# EAGLE design usir_board (EAGLE 7.1.0)
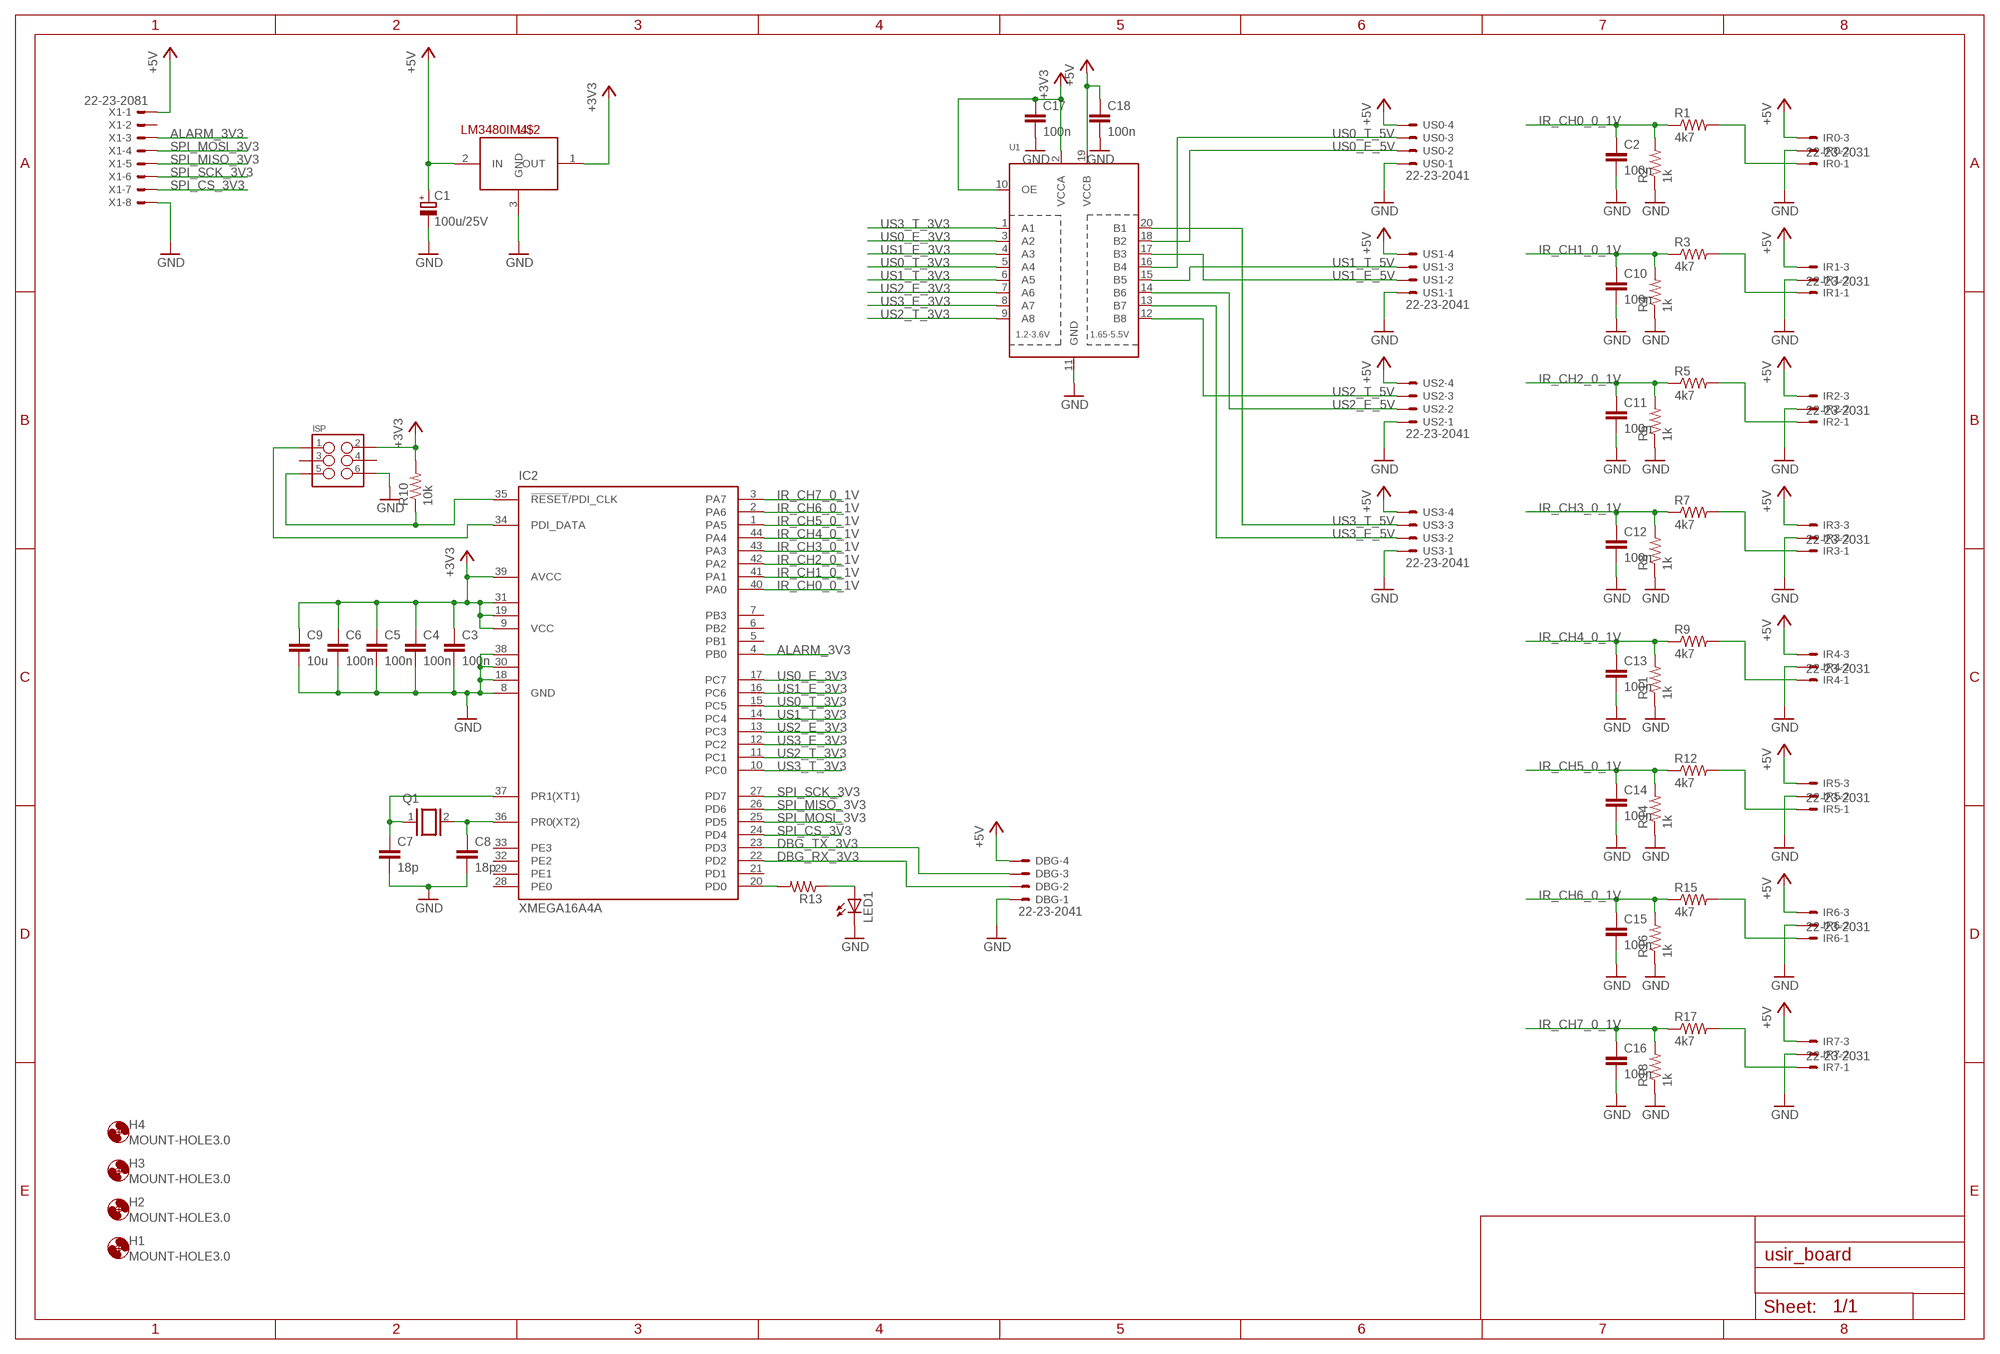
[diagram p0: schematic, sheet 1]

## Parts
C1  100u/25V  CPOL-EUE  [PANASONIC_E]
C2  100n  C-EUC0603  [C0603]
C3  100n  C-EUC0603  [C0603]
C4  100n  C-EUC0603  [C0603]
C5  100n  C-EUC0603  [C0603]
C6  100n  C-EUC0603  [C0603]
C7  18p  C-EUC0603  [C0603]
C8  18p  C-EUC0603  [C0603]
C9  10u  C-EUC0805  [C0805]
C10  100n  C-EUC0603  [C0603]
C11  100n  C-EUC0603  [C0603]
C12  100n  C-EUC0603  [C0603]
C13  100n  C-EUC0603  [C0603]
C14  100n  C-EUC0603  [C0603]
C15  100n  C-EUC0603  [C0603]
C16  100n  C-EUC0603  [C0603]
C17  100n  C-EUC0603  [C0603]
C18  100n  C-EUC0603  [C0603]
DBG  22-23-2041  [22-23-2041]
H1  MOUNT-HOLE3.0  [3,0]
H2  MOUNT-HOLE3.0  [3,0]
H3  MOUNT-HOLE3.0  [3,0]
H4  MOUNT-HOLE3.0  [3,0]
IC2  XMEGA16A4A  [TQFP44]
IR0  22-23-2031  [22-23-2031]
IR1  22-23-2031  [22-23-2031]
IR2  22-23-2031  [22-23-2031]
IR3  22-23-2031  [22-23-2031]
IR4  22-23-2031  [22-23-2031]
IR5  22-23-2031  [22-23-2031]
IR6  22-23-2031  [22-23-2031]
IR7  22-23-2031  [22-23-2031]
ISP  M03X2POGO_PINS  [2X3_POGO]
LED1  LEDCHIP-LED0603  [CHIP-LED0603]
Q1  XTAL/S  [QS]
R1  4k7  R-US_R0603  [R0603]
R2  1k  R-US_R0603  [R0603]
R3  4k7  R-US_R0603  [R0603]
R4  1k  R-US_R0603  [R0603]
R5  4k7  R-US_R0603  [R0603]
R6  1k  R-US_R0603  [R0603]
R7  4k7  R-US_R0603  [R0603]
R8  1k  R-US_R0603  [R0603]
R9  4k7  R-US_R0603  [R0603]
R10  10k  R-US_R0603  [R0603]
R11  1k  R-US_R0603  [R0603]
R12  4k7  R-US_R0603  [R0603]
R13  R-US_R0603  [R0603]
R14  1k  R-US_R0603  [R0603]
R15  4k7  R-US_R0603  [R0603]
R16  1k  R-US_R0603  [R0603]
R17  4k7  R-US_R0603  [R0603]
R18  1k  R-US_R0603  [R0603]
U1  TXB0108PWR  [TSSOP20]
U$2  LM3480IM4  [SOT23-3]
US0  22-23-2041  [22-23-2041]
US1  22-23-2041  [22-23-2041]
US2  22-23-2041  [22-23-2041]
US3  22-23-2041  [22-23-2041]
X1  22-23-2081  [22-23-2081]

## Nets
+3V3: C3.1 C4.1 C5.1 C6.1 C9.1 C17.1 IC2.9(VCC) IC2.19(VCC1) IC2.31(VCC2) IC2.39(AVCC) ISP.P$2 R10.2 U1.2(VCCA) U1.10(OE) U$2.1(OUT)
+5V: C1.+ C18.1 DBG.4 IR0.3 IR1.3 IR2.3 IR3.3 IR4.3 IR5.3 IR6.3 IR7.3 U1.19(VCCB) U$2.2(IN) US0.4 US1.4 US2.4 US3.4 X1.1
ALARM_3V3: IC2.4(PB0) X1.3
DBG_RX_3V3: DBG.2 IC2.22(PD2)
DBG_TX_3V3: DBG.3 IC2.23(PD3)
GND: C1.- C2.2 C3.2 C4.2 C5.2 C6.2 C7.2 C8.2 C9.2 C10.2 C11.2 C12.2 C13.2 C14.2 C15.2 C16.2 C17.2 C18.2 DBG.1 IC2.8(GND) IC2.18(GND1) IC2.30(GND2) IC2.38(GND3) IR0.2 IR1.2 IR2.2 IR3.2 IR4.2 IR5.2 IR6.2 IR7.2 ISP.P$6 LED1.C R2.1 R4.1 R6.1 R8.1 R11.1 R14.1 R16.1 R18.1 U1.11(GND) U$2.3(GND) US0.1 US1.1 US2.1 US3.1 X1.8
IR_CH0_0_1V: C2.1 IC2.40(PA0) R1.1 R2.2
IR_CH1_0_1V: C10.1 IC2.41(PA1) R3.1 R4.2
IR_CH2_0_1V: C11.1 IC2.42(PA2) R5.1 R6.2
IR_CH3_0_1V: C12.1 IC2.43(PA3) R7.1 R8.2
IR_CH4_0_1V: C13.1 IC2.44(PA4) R9.1 R11.2
IR_CH5_0_1V: C14.1 IC2.1(PA5) R12.1 R14.2
IR_CH6_0_1V: C15.1 IC2.2(PA6) R15.1 R16.2
IR_CH7_0_1V: C16.1 IC2.3(PA7) R17.1 R18.2
N$1: IR1.1 R3.2
N$2: IR0.1 R1.2
N$3: IR2.1 R5.2
N$4: LED1.A R13.1
N$5: IC2.34(PDI_DATA) ISP.P$1
N$6: C8.1 IC2.36(PR0(XT2)) Q1.2
N$7: C7.1 IC2.37(PR1(XT1)) Q1.1
N$8: IR3.1 R7.2
N$9: IR4.1 R9.2
N$10: IC2.35(!RESET!/PDI_CLK) ISP.P$5 R10.1
N$11: IR5.1 R12.2
N$12: IC2.20(PD0) R13.2
N$13: IR6.1 R15.2
N$14: IR7.1 R17.2
SPI_CS_3V3: IC2.24(PD4) X1.7
SPI_MISO_3V3: IC2.26(PD6) X1.5
SPI_MOSI_3V3: IC2.25(PD5) X1.4
SPI_SCK_3V3: IC2.27(PD7) X1.6
US0_E_3V3: IC2.17(PC7) U1.3(A2)
US0_E_5V: U1.18(B2) US0.2
US0_T_3V3: IC2.15(PC5) U1.5(A4)
US0_T_5V: U1.16(B4) US0.3
US1_E_3V3: IC2.16(PC6) U1.4(A3)
US1_E_5V: U1.17(B3) US1.2
US1_T_3V3: IC2.14(PC4) U1.6(A5)
US1_T_5V: U1.15(B5) US1.3
US2_E_3V3: IC2.13(PC3) U1.7(A6)
US2_E_5V: U1.14(B6) US2.2
US2_T_3V3: IC2.11(PC1) U1.9(A8)
US2_T_5V: U1.12(B8) US2.3
US3_E_3V3: IC2.12(PC2) U1.8(A7)
US3_E_5V: U1.13(B7) US3.2
US3_T_3V3: IC2.10(PC0) U1.1(A1)
US3_T_5V: U1.20(B1) US3.3
Unconnected: IC2.5(PB1) IC2.6(PB2) IC2.7(PB3) IC2.21(PD1) IC2.28(PE0) IC2.29(PE1) IC2.32(PE2) IC2.33(PE3) ISP.P$3 ISP.P$4 X1.2

## Library data of the parts
C1 = rcl:CPOL-EU: POLARIZED CAPACITOR, European symbol
C2-C18 = rcl:C-EU: CAPACITOR, European symbol
DBG US0 US1-US3 = con-molex:22-23-2041: .100" (2.54mm) Center Header - 4 Pin; MF: MOLEX; MPN: 22-23-2041; OC_FARNELL: 1462920; OC_NEWARK: 38C0355
H1-H4 = holes:MOUNT-HOLE: MOUNTING HOLE with drill center marker
IC2 = atmel:XMEGA16A4: MICROCONTROLLER Features High-performance, Low-power 8/16-bit AVR XMEGA Microcontroller Non-Volatile Program and Data Memories - 16 KB - 128 KB of In-System Self-Programmable Flash - 4 KB - 8 KB Boot Code Section with Independent Lock Bits - 1 KB - 2 KB EEPROM - 2 KB - 8 KB Internal SRAM Peripheral Features - Four-channel DMA Controller with support for external requests - Eight-channel Event System - Five 16-bit Timer/Counters Three Timer/Counters with 4 Output Compare or Input Capture channels Two Timer/Counters with 2 Output Compare or Input Capture channels High-Resolution Extensions on all Timer/Counters Advanced Waveform Extension on one Timer/Counter - Five USARTs IrDA Extension on one USART - Two Two-Wire Interfaces with dual address match (I2C and SMBus compatible) - Two SPIs (Serial Peripheral Interfaces) peripherals - AES and DES Crypto Engine - 16-bit Real Time Counter with Separate Oscillator - One Twelve-channel, 12-bit, 2 Msps Analog to Digital Converter - One Two-channel, 12-bit, 1 Msps Digital to Analog Converter - Two Analog Comparators with Window compare function - External Interrupts on all General Purpose I/O pins - Programmable Watchdog Timer with Separate On-chip Ultra Low Power Oscillator Special Microcontroller Features - Power-on Reset and Programmable Brown-out Detection - Internal and External Clock Options with PLL - Programmable Multi-level Interrupt Controller - Sleep Modes: Idle, Power-down, Standby, Power-save, Extended Standby - Advanced Programming, Test and Debugging Interfaces PDI (Program and Debug Interface) for programming, test and debugging I/O and Packages - 34 Programmable I/O Lines - 44 - lead TQFP - 44 - pad VQFN/QFN - 49 - ball VFBGA Operating Voltage - 1.6 - 3.6V Speed performance - 0 - 12 MHz @ 1.6 - 3.6V - 0 - 32 MHz @ 2.7 - 3.6V Drawn by Dipl.-Ing. (FH) Robert Siegler Created: 27.05.09; OC_FARNELL: unknown; OC_NEWARK: unknown
IR0 IR1-IR7 = con-molex:22-23-2031: .100" (2.54mm) Center Header - 3 Pin; MF: MOLEX; MPN: 22-23-2031; OC_FARNELL: 1462950; OC_NEWARK: 30C0862
ISP = SparkFun-Connectors:M03X2: 2x3 .1" header. Shrouded, with keying- CONN-10681 SMT- CONN-11415 Pogo pins- HW-11044; PROD_ID: HW-11044
LED1 = led:LED: LED OSRAM: - CHIPLED LG R971, LG N971, LY N971, LG Q971, LY Q971, LO R971, LY R971 LH N974, LH R974 LS Q976, LO Q976, LY Q976 LO Q996 - Hyper CHIPLED LW Q18S LB Q993, LB Q99A, LB R99A - SideLED LS A670, LO A670, LY A670, LG A670, LP A670 LB A673, LV A673, LT A673, LW A673 LH A674 LY A675 LS A676, LA A676, LO A676, LY A676, LW A676 LS A679, LY A679, LG A679 - Hyper Micro SIDELED® LS Y876, LA Y876, LO Y876, LY Y876 LT Y87S - SmartLED LW L88C, LW L88S LB L89C, LB L89S, LG L890 LS L89K, LO L89K, LY L89K LS L896, LA L896, LO L896, LY L896 - TOPLED LS T670, LO T670, LY T670, LG T670, LP T670 LSG T670, LSP T670, LSY T670, LOP T670, LYG T670 LG T671, LOG T671, LSG T671 LB T673, LV T673, LT T673, LW T673 LH T674 LS T676, LA T676, LO T676, LY T676, LB T676, LH T676, LSB T676, LW T676 LB T67C, LV T67C, LT T67C, LS T67K, LO T67K, LY T67K, LW E67C LS E67B, LA E67B, LO E67B, LY E67B, LB E67C, LV E67C, LT E67C LW T67C LS T679, LY T679, LG T679 LS T770, LO T770, LY T770, LG T770, LP T770 LB T773, LV T773, LT T773, LW T773 LH T774 LS E675, LA E675, LY E675, LS T675 LS T776, LA T776, LO T776, LY T776, LB T776 LHGB T686 LT T68C, LB T68C - Hyper Mini TOPLED® LB M676 - Mini TOPLED Santana® LG M470 LS M47K, LO M47K, LY M47K Source: http://www.osram.convergy.de LUXEON: - LUMILED® LXK2-PW12-R00, LXK2-PW12-S00, LXK2-PW14-U00, LXK2-PW14-V00 LXK2-PM12-R00, LXK2-PM12-S00, LXK2-PM14-U00 LXK2-PE12-Q00, LXK2-PE12-R00, LXK2-PE12-S00, LXK2-PE14-T00, LXK2-PE14-U00 LXK2-PB12-K00, LXK2-PB12-L00, LXK2-PB12-M00, LXK2-PB14-N00, LXK2-PB14-P00, LXK2-PB14-Q00 LXK2-PR12-L00, LXK2-PR12-M00, LXK2-PR14-Q00, LXK2-PR14-R00 LXK2-PD12-Q00, LXK2-PD12-R00, LXK2-PD12-S00 LXK2-PH12-R00, LXK2-PH12-S00 LXK2-PL12-P00, LXK2-PL12-Q00, LXK2-PL12-R00 Source: www.luxeon.com KINGBRIGHT: KA-3528ASYC Source: www.kingbright.com
Q1 = special:XTAL/S: CRYSTAL
R1-R18 = rcl:R-US_: RESISTOR, American symbol
U1 = adafruit:TXB0108PWR: 8-Bit Bi-Directional Level Shifter 1.2V-3.6V (VCCA) to 1.65V-5.5V (VCCB) bi-directional level shifter with auto direction sensing. Max data rate - VCCA 1.8V: 20Mbps (50ns), VCCA 3.3V: 100Mbps (10ns) Digikey: 296-21527-1-ND
U$2 = SparkFun-PowerIC:LM3480IM4: Small package linear regulator
X1 = con-molex:22-23-2081: .100" (2.54mm) Center Header - 8 Pin; MF: MOLEX; MPN: 22-23-2081; OC_FARNELL: 1756826; OC_NEWARK: 01C7592

## Board
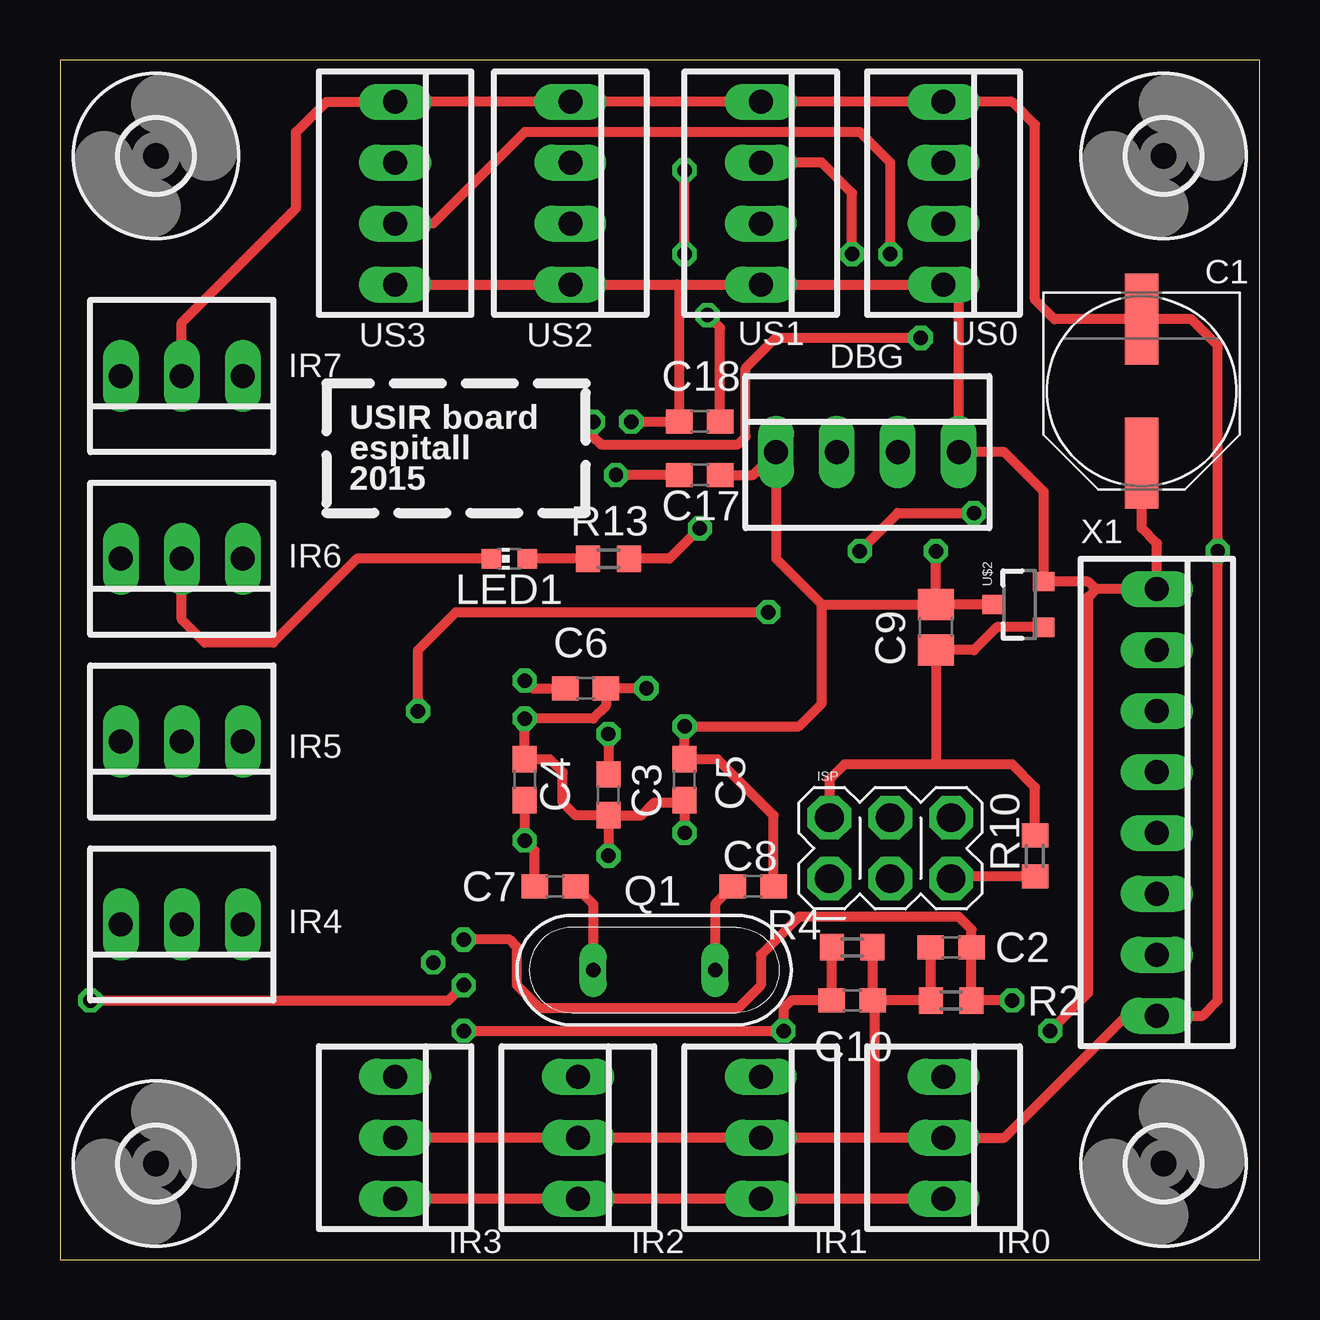
[diagram p1: board, top side]
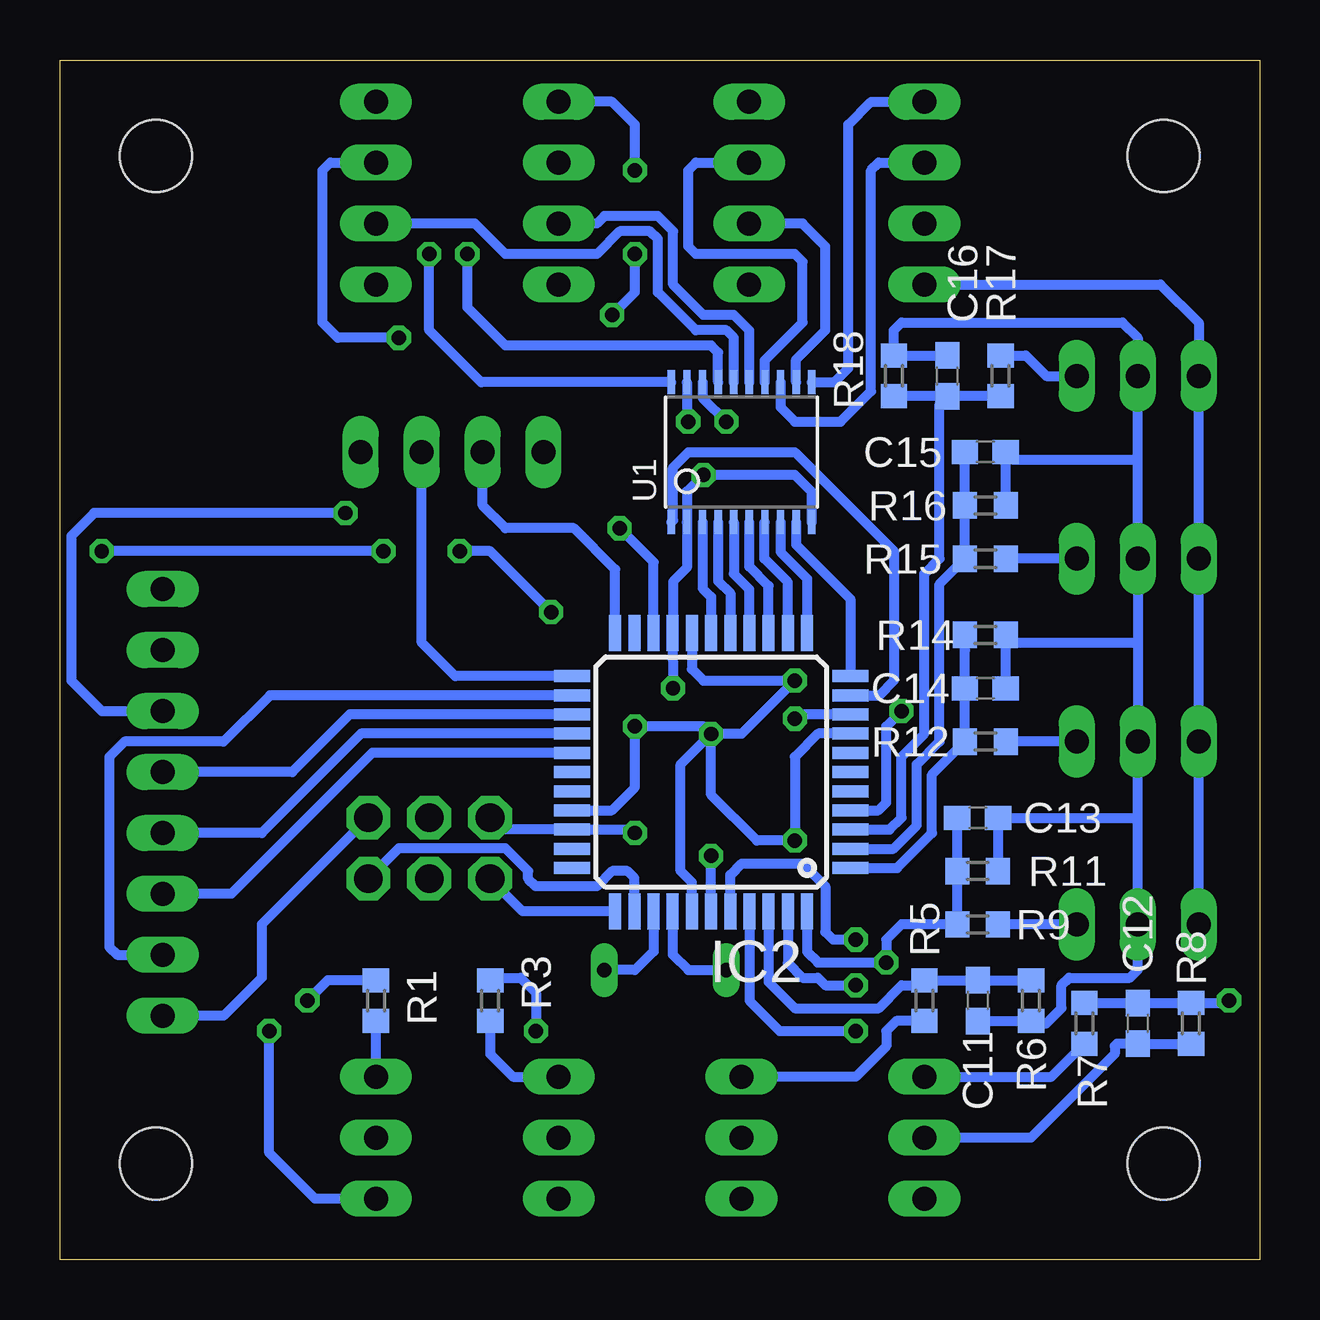
[diagram p2: board, bottom side, seen from below]

Size 50 x 50 mm. Coordinates in mm from the lower left corner, seen from the top.
Outline: 0,0 50,0 50,50 0,50 0,0
Copper layers (1*16): Top 0.035mm / dielectric 1.5mm / Bottom 0.035mm
Design rules "default": minimum track width 10mil, minimum drill 24mil, track to track 8mil, track to pad 8mil, pad to pad 8mil, via to via 8mil, smd to smd 8mil, copper to edge 40mil, drill to drill 8mil, minimum pad ring 10mil, minimum via ring 8mil, stop-mask expansion 4mil, vias tented up to drill 0mil, thermal gap 10mil

### Footprints (pad centres in the part's own frame; a part is rotated, then mirrored left to right if it is on the bottom)
PANASONIC_E = smd 3.8 x 1.4: + 3,0; - -3,0
C0603 = smd 1.1 x 1: 1 -0.85,0; 2 0.85,0
C0805 = smd 1.3 x 1.5: 1 -0.95,0; 2 0.95,0
22-23-2041 = drill 1 long: 1 -3.81,0; 2 -1.27,0; 3 1.27,0; 4 3.81,0
3,0 = hole 3: 0,0
TQFP44 = smd 1.5 x 0.5: 1 -5.8,4; 2 -5.8,3.2; 3 -5.8,2.4; 4 -5.8,1.6; 5 -5.8,0.8; 6 -5.8,0; 7 -5.8,-0.8; 8 -5.8,-1.6; 9 -5.8,-2.4; 10 -5.8,-3.2; 11 -5.8,-4; 23 5.8,-4; 24 5.8,-3.2; 25 5.8,-2.4; 26 5.8,-1.6; 27 5.8,-0.8; 28 5.8,0; 29 5.8,0.8; 30 5.8,1.6; 31 5.8,2.4; 32 5.8,3.2; 33 5.8,4 | smd 0.5 x 1.5: 12 -4,-5.8; 13 -3.2,-5.8; 14 -2.4,-5.8; 15 -1.6,-5.8; 16 -0.8,-5.8; 17 0,-5.8; 18 0.8,-5.8; 19 1.6,-5.8; 20 2.4,-5.8; 21 3.2,-5.8; 22 4,-5.8; 34 4,5.8; 35 3.2,5.8; 36 2.4,5.8; 37 1.6,5.8; 38 0.8,5.8; 39 0,5.8; 40 -0.8,5.8; 41 -1.6,5.8; 42 -2.4,5.8; 43 -3.2,5.8; 44 -4,5.8
22-23-2031 = drill 1 long: 1 -2.54,0; 2 0,0; 3 2.54,0
2X3_POGO = drill 1.2 pad 1.829 octagon: P$1 0,0; P$2 0,2.54; P$3 2.54,0; P$4 2.54,2.54; P$5 5.08,0; P$6 5.08,2.54
CHIP-LED0603 = smd 0.8 x 0.8: A 0,-0.75; C 0,0.75
QS = drill 0.61 long: 1 -2.54,0; 2 2.54,0
R0603 = smd 1 x 1.1: 1 -0.85,0; 2 0.85,0
TSSOP20 = smd 0.305 x 0.991: 1 -2.925,-2.918; 2 -2.275,-2.918; 3 -1.625,-2.918; 4 -0.975,-2.918; 5 -0.325,-2.918; 6 0.325,-2.918; 7 0.975,-2.918; 8 1.625,-2.918; 9 2.275,-2.918; 10 2.925,-2.918; 11 2.925,2.918; 12 2.275,2.918; 13 1.625,2.918; 14 0.975,2.918; 15 0.325,2.918; 16 -0.325,2.918; 17 -0.975,2.918; 18 -1.625,2.918; 19 -2.275,2.918; 20 -2.925,2.918
SOT23-3 = smd 0.8 x 0.9: 1 -0.95,-1; 2 0.95,-1; 3 0,1.1
22-23-2081 = drill 1 long: 1 -8.89,0; 2 -6.35,0; 3 -3.81,0; 4 -1.27,0; 5 1.27,0; 6 3.81,0; 7 6.35,0; 8 8.89,0

### Placement (x,y rotation side)
C1  45.09,36.2 270 top
C2  37.15,13.02 180 top
C3  22.86,19.37 90 top
C4  19.37,20 270 top
C5  26.04,20 90 top
C6  21.91,23.81 180 top
C7  20.64,15.56 180 top
C8  28.89,15.56 0 top
C9  36.51,26.35 90 top
C10  33.02,10.79 0 top
C11  11.75,10.79 270 bottom
C12  5.08,9.84 270 bottom
C13  11.75,18.41 0 bottom
C14  11.43,23.81 0 bottom
C15  11.43,33.66 0 bottom
C16  13.02,36.83 90 bottom
C17  26.67,32.7 0 top
C18  26.67,34.92 0 top
DBG  33.66,33.66 0 top
H1  4,4 0 top
H2  46,4 0 top
H3  4,46 0 top
H4  46,46 0 top
IC2  22.86,20.32 180 bottom
IR0  36.83,5.08 270 top
IR1  29.21,5.08 270 top
IR2  21.59,5.08 270 top
IR3  13.97,5.08 270 top
IR4  5.08,13.97 180 top
IR5  5.08,21.59 180 top
IR6  5.08,29.21 180 top
IR7  5.08,36.83 180 top
ISP  32.07,15.88 0 top
LED1  18.73,29.21 90 top
Q1  24.77,12.06 0 top
R1  36.83,10.79 270 bottom
R2  37.15,10.79 0 top
R3  32.07,10.79 270 bottom
R4  33.02,13.02 180 top
R5  13.97,10.79 270 bottom
R6  9.53,10.79 90 bottom
R7  7.3,9.84 270 bottom
R8  2.86,9.84 90 bottom
R9  11.75,13.97 0 bottom
R10  40.64,16.83 90 top
R11  11.75,16.19 180 bottom
R12  11.43,21.59 0 bottom
R13  22.86,29.21 0 top
R14  11.43,26.04 180 bottom
R15  11.43,29.21 0 bottom
R16  11.43,31.43 180 bottom
R17  10.79,36.83 90 bottom
R18  15.24,36.83 270 bottom
U1  21.59,33.66 0 bottom
U$2  40.01,27.3 90 top
US0  36.83,44.45 270 top
US1  29.21,44.45 270 top
US2  21.27,44.45 270 top
US3  13.97,44.45 270 top
X1  45.72,19.05 270 top

### Tracks (layer width: path | path; a pad name or v marks a point on that pad's centre or on a via)
+3V3  (via drill 0.6)
  Top 0.406: U$2.1 39.05,26.36 38.1,25.4 C9.1 | C9.1 | C3.1 v22.86,16.83 | v26.04,17.78 C5.1 25.93,19.05 24.77,19.05 24.23,18.52 C3.1 | v24.45,23.81 C6.1 22.76,23.07 22.23,22.54 v19.37,22.54 C4.1 20.42,20.85 20.95,20.32 20.95,19.05 21.49,18.52 C3.1 | C17.1 v23.18,32.7 | R10.2 40.64,19.68 39.69,20.64 36.51,20.64 | 36.51,20.64 32.7,20.64 32.07,20 ISP.P$2 | C9.1 36.52,20.64 36.51,20.64
  Bottom 0.406: v24.45,23.81 IC2.19 24.45,26.13 24.45,28.26 23.86,28.84 U1.2 23.86,32.02 v23.18,32.7 19.37,32.7 18.66,32 U1.10 | v26.04,17.78 26.04,17.92 IC2.31 31.57,17.92 ISP.P$2 | IC2.39 v22.86,16.83 | IC2.9 19.37,22.72 v19.37,22.54
+5V  (via drill 0.6)
  Top 0.406: 43.18,27.94 X1.1 45.72,29.84 45.09,30.48 C1.+ | 43.18,27.94 42.86,28.26 U$2.2 | U$2.2 | U$2.2 41.01,32.02 39.37,33.66 DBG.4 37.47,40.01 US0.4 US1.4 25.72,40.64 | v23.81,34.92 C18.1 25.82,40.54 25.72,40.64 | US3.4 US2.4 25.72,40.64 | IR3.3 IR2.3 IR1.3 IR0.3 | v41.27,9.53 42.86,11.11 42.86,27.62 43.18,27.94
  Bottom 0.406: U1.19 23.86,34.98 v23.81,34.92 | IR4.3 IR5.3 IR6.3 IR7.3 2.54,39.05 4.13,40.64 US3.4 | IR0.3 39.37,2.54 41.27,4.45 v41.27,9.53
ALARM_3V3  (via drill 0.6)
  Top 0.406: v14.92,22.86 14.92,25.4 16.51,26.99 v29.53,26.99 | v33.34,29.53 34.92,31.11 v38.1,31.11
  Bottom 0.406: IC2.4 15.89,18.72 15.56,19.05 15.56,22.23 v14.92,22.86 | v29.53,26.99 32.07,29.53 v33.34,29.53 | v38.1,31.11 48.58,31.11 49.53,30.16 49.53,24.13 48.26,22.86 X1.3
DBG_RX_3V3
  Bottom 0.406: IC2.22 26.86,28.77 28.57,30.48 31.43,30.48 32.38,31.43 DBG.2
DBG_TX_3V3
  Bottom 0.406: IC2.23 33.53,24.32 34.92,25.72 DBG.3
GND  (via drill 0.6)
  Top 0.406: v19.37,24.13 19.68,23.81 C6.2 | v22.86,21.91 C3.2 | C4.2 v19.37,17.46 19.79,17.04 C7.2 | 31.75,27.3 29.84,29.21 DBG.1 28.89,32.7 C17.2 | 31.75,27.3 C9.2 | C18.2 27.52,38.84 v26.99,39.37 | v26.04,41.91 v26.04,45.4 | C9.2 v36.52,29.52 v36.51,29.53 | U$2.3 C9.2 | 31.75,27.3 31.75,23.18 30.8,22.23 v26.04,22.23 C5.2 27.41,20.85 29.74,18.52 C8.2 | R4.1 C10.2 | C10.2 R2.1 C2.2 | 33.97,5.08 IR1.2 IR2.2 IR3.2 | 33.97,5.08 33.97,10.69 C10.2 | 33.97,5.08 IR0.2 39.37,5.08 44.45,10.16 X1.8 47.62,10.16 48.26,10.79 v48.26,29.53 48.26,38.1 47.16,39.2 C1.- 41.45,39.2 40.64,40.01 40.64,47.31 39.69,48.26 US0.1 US1.1 US2.1 US3.1 11.11,48.26 9.84,46.99 9.84,43.81 5.08,39.05 IR7.2 | LED1.C 12.38,29.21 8.89,25.72 6.03,25.72 5.08,26.67 IR6.2
  Bottom 0.406: IC2.18 23.66,24.61 23.18,24.13 v19.37,24.13 21.59,21.91 v22.86,21.91 | IC2.8 18.4,21.92 19.37,20.95 v19.37,17.46 20.95,17.46 22.86,19.37 v22.86,21.91 | IC2.38 23.66,15.72 24.13,16.19 24.13,20.64 v22.86,21.91 | IC2.30 27,18.72 26.04,19.68 v26.04,22.23 23.18,22.23 v22.86,21.91 | U1.11 17.72,36.57 17.14,37.15 17.14,47.31 16.19,48.26 US3.1 | v26.99,39.37 26.04,40.32 v26.04,41.91 | v26.04,45.4 26.04,47.31 26.99,48.26 US1.1 | v36.51,29.53 v48.26,29.53 | ISP.P$6 41.59,13.97 41.59,11.75 43.18,10.16 X1.8 | C11.2 R6.1 9.42,9.84 8.89,9.84 8.26,10.48 8.26,11.43 7.94,11.75 5.4,11.75 5.08,12.06 IR4.2 5.08,18.41 | R8.1 C12.2 5.93,8.99 6.03,8.89 6.03,8.57 9.53,5.08 IR3.2 | R11.1 C13.2 5.08,18.41 | C14.2 R14.1 10.26,25.72 5.08,25.72 | C16.2 R18.1 15.24,38.73 14.92,39.05 5.71,39.05 5.08,38.42 IR7.2 5.08,33.34 | 5.08,25.72 IR6.2 5.08,33.34 | 5.08,25.72 IR5.2 5.08,18.41 | 10.16,33.34 10.26,33.34 C15.2 R16.1 10.58,33.55 10.48,33.66 | 10.79,33.66 10.48,33.66 | 10.48,33.66 10.16,33.34 | 10.16,33.34 7.3,33.34 5.08,33.34
IR_CH0_0_1V  (via drill 0.6)
  Top 0.406: v16.83,13.34 18.73,13.34 19.05,13.02 19.05,11.43 20,10.48 28.26,10.48 29.21,11.43 29.21,12.7 30.8,14.29 37.47,14.29 38,13.76 C2.1 R2.2 v39.69,10.79
  Bottom 0.406: IC2.40 22.06,16.04 21.59,16.51 19.05,16.51 18.1,15.56 18.1,13.65 17.78,13.34 v16.83,13.34 | R1.1 38.84,11.64 v39.69,10.79
IR_CH1_0_1V  (via drill 0.6)
  Top 0.406: v16.83,9.53 v30.16,9.53 30.16,10.48 30.48,10.79 C10.1 R4.2
  Bottom 0.406: IC2.41 21.26,10.78 20,9.53 v16.83,9.53 | R3.1 31.96,11.75 30.8,11.75 30.16,11.11 v30.16,9.53
IR_CH2_0_1V
  Bottom 0.406: IC2.42 20.46,11.57 19.37,10.48 15.88,10.48 14.92,11.43 14.19,11.43 R5.1 C11.1 R6.2
IR_CH3_0_1V  (via drill 0.6)
  Top 0.406: v1.27,10.79 16.19,10.79 v16.83,11.43
  Bottom 0.406: IC2.43 19.66,12.36 19.05,11.75 18.41,11.75 18.1,11.43 v16.83,11.43 | v1.27,10.79 1.37,10.69 R8.2 C12.1 R7.1
IR_CH4_0_1V  (via drill 0.6)
  Bottom 0.406: IC2.44 18.86,12.83 18.41,12.38 v15.56,12.38 15.56,13.34 14.92,13.97 R9.1 R11.2 C13.1
IR_CH5_0_1V
  Bottom 0.406: R14.2 12.28,25.4 C14.1 R12.1 13.65,20.22 13.65,17.78 15.11,16.32 IC2.1
IR_CH6_0_1V
  Bottom 0.406: C15.1 R16.2 R15.1 13.34,28.16 13.34,21.59 14.29,20.64 14.29,18.1 15.27,17.12 IC2.2
IR_CH7_0_1V
  Bottom 0.406: R17.1 C16.1 | C16.1 R18.2 | IC2.3 15.42,17.92 14.92,18.41 14.92,20.95 13.97,21.91 13.97,28.57 13.34,29.21 13.34,35.66 C16.1
N$1
  Bottom 0.406: R3.2 32.07,8.57 31.11,7.62 IR1.1
N$2
  Bottom 0.406: IR0.1 R1.2
N$3
  Bottom 0.406: R5.2 15.14,9.95 15.56,9.53 15.56,8.89 16.83,7.62 IR2.1
N$4
  Top 0.406: R13.1 LED1.A
N$5
  Bottom 0.406: IC2.34 30.71,14.52 ISP.P$1
N$6
  Top 0.406: C8.1 27.3,14.82 Q1.2
  Bottom 0.406: IC2.36 25.26,12.84 26.04,12.06 Q1.2
N$7
  Top 0.406: C7.1 22.23,14.82 Q1.1
  Bottom 0.406: IC2.37 24.46,12.71 23.81,12.06 Q1.1
N$8
  Bottom 0.406: IR3.1 8.68,7.62 R7.2
N$9
  Bottom 0.406: IR4.1 R9.2
N$10
  Top 0.406: R10.1 37.25,15.98 ISP.P$5
  Bottom 0.406: IC2.35 26.06,15.9 26.35,16.19 26.99,16.19 27.62,15.56 30.16,15.56 30.48,15.88 30.48,16.19 31.43,17.14 35.88,17.14 ISP.P$5
N$11
  Bottom 0.406: IR5.1 R12.2
N$12  (via drill 0.6)
  Top 0.406: v26.67,30.48 25.4,29.21 R13.2
  Bottom 0.406: IC2.20 25.26,29.07 v26.67,30.48
N$13
  Bottom 0.406: IR6.1 R15.2
N$14
  Bottom 0.406: R17.2 9.74,37.68 8.89,36.83 IR7.1
SPI_CS_3V3
  Bottom 0.406: IC2.24 41.25,23.52 43.18,21.59 47.31,21.59 47.94,20.95 47.94,13.02 47.62,12.7 X1.7
SPI_MISO_3V3
  Bottom 0.406: IC2.26 37.45,21.92 41.59,17.78 X1.5
SPI_MOSI_3V3
  Bottom 0.406: IC2.25 37.92,22.72 40.32,20.32 X1.4
SPI_SCK_3V3
  Bottom 0.406: IC2.27 36.98,21.12 42.86,15.24 X1.6
US0_E_3V3
  Bottom 0.406: U1.3 23.21,27.98 22.86,27.62 IC2.17
US0_E_5V  (via drill 0.6)
  Top 0.406: v22.23,34.92 22.23,34.29 22.54,33.97 28.26,33.97 28.57,34.29 28.57,37.15 29.84,38.42 v35.88,38.42
  Bottom 0.406: U1.18 23.21,35.91 v22.23,34.92 | v35.88,38.42 38.42,38.42 39.05,39.05 39.05,45.4 38.73,45.72 US0.2
US0_T_3V3
  Bottom 0.406: U1.5 21.91,28.58 21.27,27.94 21.27,26.13 IC2.15
US0_T_5V
  Bottom 0.406: U1.16 21.91,38.42 22.23,38.73 23.5,38.73 25.08,40.32 25.08,42.55 25.4,42.86 26.67,42.86 27.62,41.91 31.43,41.91 32.7,43.18 US0.3
US1_E_3V3
  Bottom 0.406: U1.4 22.57,28.28 22.06,27.77 IC2.16
US1_E_5V  (via drill 0.6)
  Top 0.406: v33.02,41.91 33.02,44.45 31.75,45.72 US1.2
  Bottom 0.406: U1.17 22.57,37.8 22.86,38.1 31.43,38.1 33.02,39.69 v33.02,41.91
US1_T_3V3
  Bottom 0.406: IC2.14 20.46,28.08 21.27,28.89 U1.6
US1_T_5V
  Bottom 0.406: U1.15 21.27,38.73 21.91,39.37 23.18,39.37 24.45,40.64 24.45,42.86 25.08,43.5 27.3,43.5 27.62,43.18 US1.3
US2_E_3V3
  Bottom 0.406: IC2.13 19.66,28.23 20.64,29.21 20.64,30.71 U1.7
US2_E_5V
  Bottom 0.406: U1.14 20.61,37.49 19.05,39.05 19.05,41.59 19.37,41.91 23.5,41.91 23.81,42.23 23.81,45.4 23.5,45.72 US2.2
US2_T_3V3
  Bottom 0.406: U1.9 19.32,29.79 17.06,27.54 IC2.11
US2_T_5V
  Bottom 0.406: U1.12 19.32,37.52 18.1,38.73 18.1,42.23 19.05,43.18 US2.3
US3_E_3V3
  Bottom 0.406: U1.8 19.96,29.49 18.86,28.39 IC2.12
US3_E_5V
  Bottom 0.406: U1.13 19.96,35.52 19.37,34.92 17.46,34.92 16.19,36.2 16.19,45.4 15.88,45.72 US3.2
US3_T_3V3
  Bottom 0.406: U1.1 24.45,30.8 24.45,33.02 23.81,33.66 19.37,33.66 15.24,29.53 15.24,24.13 15.88,23.5 17.04,23.5 IC2.10
US3_T_5V  (via drill 0.6)
  Top 0.406: v34.61,41.91 34.61,45.72 33.34,46.99 19.37,46.99 15.56,43.18 US3.3
  Bottom 0.406: U1.20 32.45,36.57 34.61,38.73 v34.61,41.91

### Text on the board
tNames: USIR board | espitall | 2015